# EasyEDA Pro project ESP32管灯熊猫.eprj

# Schematic Schematic1
Create Date: 2023-11-04; Page Name: P1; Project Name: ESP32管灯熊猫; Schematic Name: Schematic1; Update Date: 2023-11-04; Page Size: A4; Version: V1.0
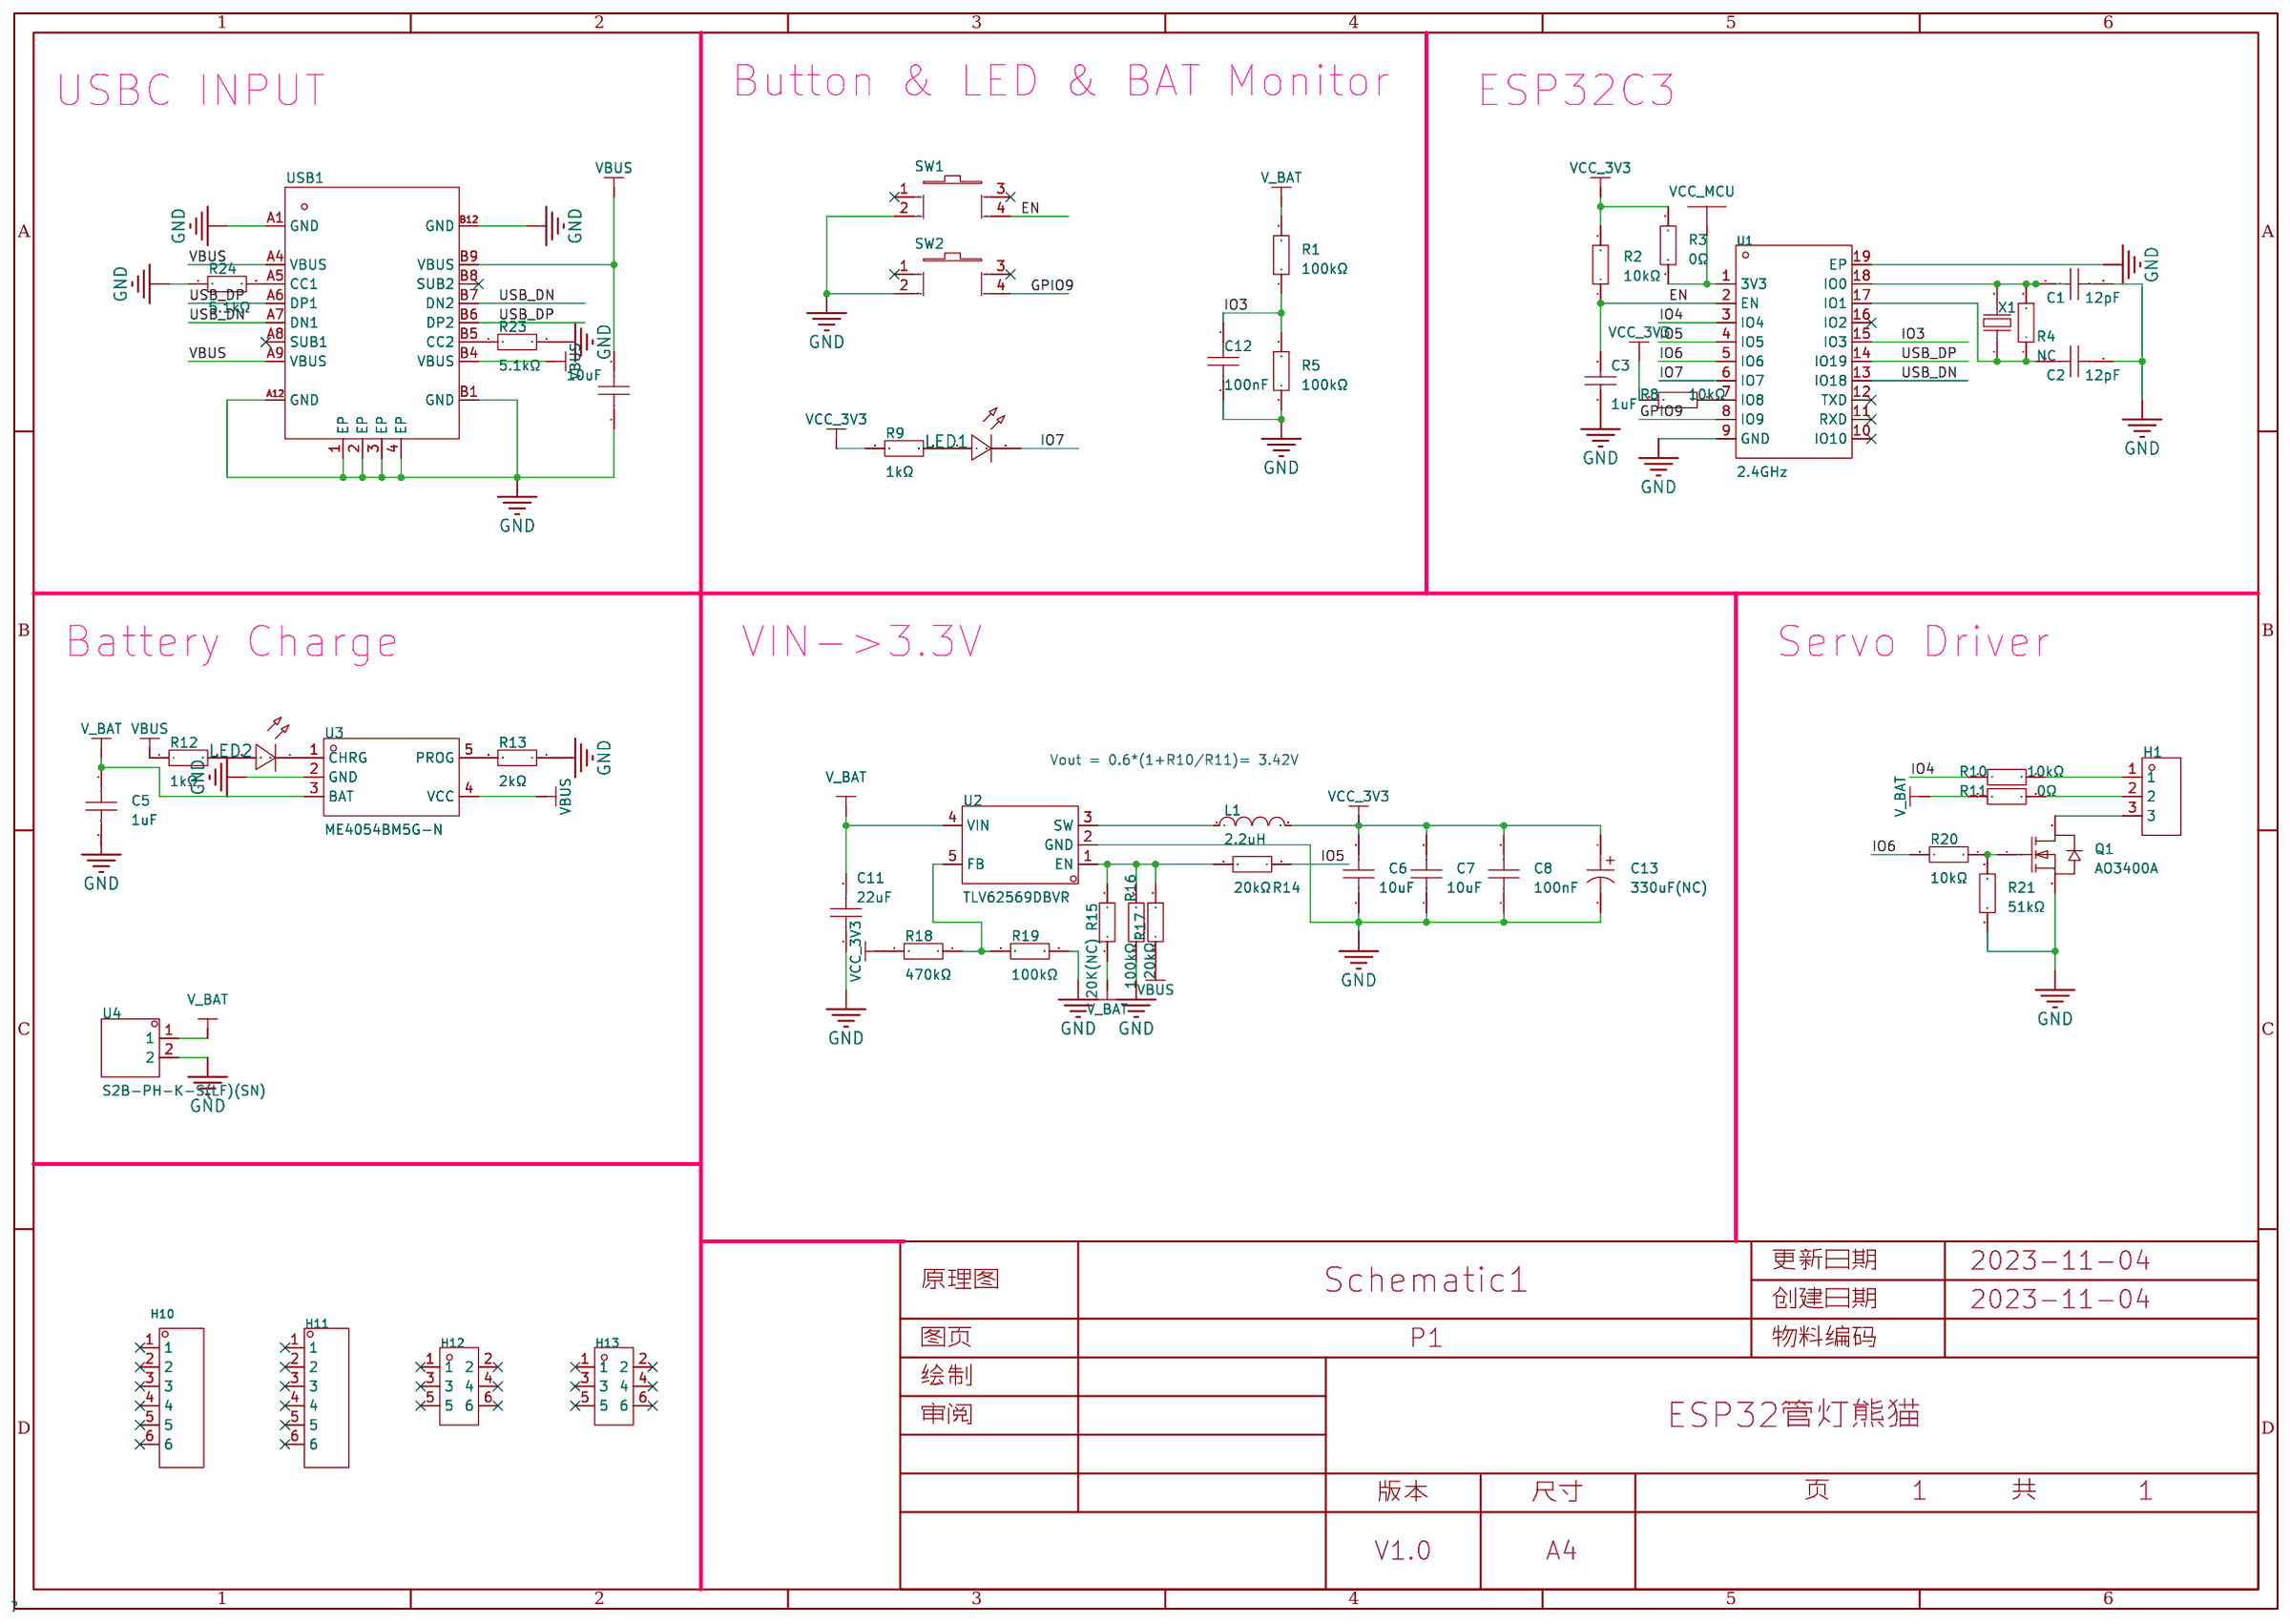
[diagram p0: schematic sheet]

## Parts
C1  12pF  [C0603]
C2  12pF  [C0603]
C3  1uF  [C0603]
C4  10uF  [C0603]
C5  1uF  [C0603]
C6  10uF  [C0603]
C7  10uF  [C0603]
C8  100nF  [C0603]
C11  22uF  [C0603]
C12  100nF  [C0603]
C13  330uF(NC)  [CAP-SMD_BD6.3-L6.6-W6.6-LS7.4-FD]
H1  -  [HDR-TH_3P-P2.54-V-M]
H10  B-2200S06P-A120  [HDR-TH_6P-P2.54-V-F]
H11  B-2200S06P-A120  [HDR-TH_6P-P2.54-V-F]
H12  X6511WVS-06H-C60D48R2  [HDR-SMD_6P-P2.54-V-M-LS4.8_R2]
H13  X6511WVS-06H-C60D48R2  [HDR-SMD_6P-P2.54-V-M-LS4.8_R2]
L1  2.2uH  [IND-SMD_L2.5-W2.0_SWPA2520]
LED1  19-217/BHC-ZL1M2RY/3T  [LED0603-FD_BLUE]
LED2  19-217/BHC-ZL1M2RY/3T  [LED0603-FD_BLUE]
Q1  AO3400A  [SOT-23-3_L2.9-W1.6-P1.90-LS2.8-BR]
R1  100kΩ  [R0603]
R2  10kΩ  [R0603]
R3  0Ω  [R0603]
R4  NC  [R0603]
R5  100kΩ  [R0603]
R8  10kΩ  [R0603]
R9  1kΩ  [R0603]
R10  10kΩ  [R0603]
R11  0Ω  [R0603]
R12  1kΩ  [R0603]
R13  2kΩ  [R0603]
R14  20kΩ  [R0603]
R15  20K(NC)  [R0603]
R16  100kΩ  [R0603]
R17  20kΩ  [R0603]
R18  470kΩ  [R0603]
R19  100kΩ  [R0603]
R20  10kΩ  [R0603]
R21  51kΩ  [R0603]
R23  5.1kΩ  [R0603]
R24  5.1kΩ  [R0603]
SW1  -  [SW-SMD_4P_PTS810SJM250SMTRLFS]
SW2  -  [SW-SMD_4P_PTS810SJM250SMTRLFS]
U1  2.4GHz  [BULETM-SMD_ESPRESSIF_ESP32-C3-WROOM-02-N4-4MB]
U2  TLV62569DBVR  [SOT-23-5_L3.0-W1.7-P0.95-LS2.8-BR]
U3  ME4054BM5G-N  [TSOT-23-5_L2.9-W1.6-P0.95-LS2.8-BL]
U4  S2B-PH-K-S(LF)(SN)  [CONN-TH_S2B-PH-K-S-LF-SN]
USB1  KH-TYPE-C-16P  [USB-C-SMD_KH-TYPE-C-16P]
X1  32.768kHz  [FC-135R_L3.2-W1.5]

## Library data of the parts
C1 C2 = CL10C120JB8NNNC: 容值:12pF;精度:±5%;额定电压:50V;材质(温度系数):C0G;; LCSC Part Name: 12pF ±5% 50V; Supplier Part: C38523; Manufacturer: SAMSUNG(三星); Supplier Footprint: 0603; JLCPCB Part Class: Basic Part; Datasheet: https://atta.szlcsc.com/upload/public/pdf/source/20160218/1457707763339.pdf; Supplier: LCSC; Tolerance: ±5%; Voltage Rated: 50V; Temperature Coefficient: C0G
C3 = CL10A105KA8NNNC: 容值:1uF;精度:±10%;额定电压:25V;温度系数:X5R;; LCSC Part Name: 1uF±10%25V; Supplier Part: C5673; Manufacturer: SAMSUNG(三星); Supplier Footprint: 0603; JLCPCB Part Class: ExtendedPart; Datasheet: https://atta.szlcsc.com/upload/public/pdf/source/20160103/1457707739994.pdf; Supplier: LCSC; Tolerance: ±10%; Voltage Rated: 25V; Temperature Coefficient: X5R
C4 = CL10A106MP8NNNC: 容值:10uF;精度:±20%;额定电压:10V;温度系数:X5R;; LCSC Part Name: 10uF±20%10V; Supplier Part: C85713; Manufacturer: SAMSUNG(三星); Supplier Footprint: 0603; JLCPCB Part Class: ExtendedPart; Datasheet: https://atta.szlcsc.com/upload/public/pdf/source/20161027/1477535406017.pdf; Supplier: LCSC; Tolerance: ±20%; Voltage Rated: 10V; Temperature Coefficient: X5R
C5 = CL10A105KB8NNNC: 容值:1uF;精度:±10%;额定电压:50V;材质(温度系数):X5R;; LCSC Part Name: 1uF ±10% 50V; Supplier Part: C15849; Manufacturer: SAMSUNG(三星); Supplier Footprint: 0603; JLCPCB Part Class: Basic Part; Datasheet: https://atta.szlcsc.com/upload/public/pdf/source/20160103/1457707679084.pdf; Supplier: LCSC; Tolerance: ±10%; Voltage Rated: 50V; Temperature Coefficient: X5R
C6 C7 = CL10A106KP8NNNC: 容值:10uF;精度:±10%;额定电压:10V;材质(温度系数):X5R;; LCSC Part Name: 10uF ±10% 10V; Supplier Part: C19702; Manufacturer: SAMSUNG(三星); Supplier Footprint: 0603; JLCPCB Part Class: Basic Part; Datasheet: https://atta.szlcsc.com/upload/public/pdf/source/20160103/1457707703378.pdf; Supplier: LCSC; Tolerance: ±10%; Voltage Rated: 10V; Temperature Coefficient: X5R
C8 C12 = CC0603KRX7R9BB104: 容值:100nF;精度:±10%;额定电压:50V;材质(温度系数):X7R;; LCSC Part Name: 100nF ±10% 50V; Supplier Part: C14663; Manufacturer: YAGEO(国巨); Supplier Footprint: 0603; JLCPCB Part Class: Basic Part; Datasheet: https://atta.szlcsc.com/upload/public/pdf/source/20180910/C282072_33301C7F631E79921B82A8DAC6BCC5B3.pdf; Supplier: LCSC; Tolerance: ±10%; Voltage Rated: 50V; Temperature Coefficient: X7R
C11 = CL10A226MQ8NRNC: 容值:22uF;精度:±20%;额定电压:6.3V;材质(温度系数):X5R;; LCSC Part Name: 22uF ±20% 6.3V; Supplier Part: C59461; Manufacturer: SAMSUNG(三星); Supplier Footprint: 0603; JLCPCB Part Class: Basic Part; Datasheet: https://atta.szlcsc.com/upload/public/pdf/source/20160103/1457707740762.pdf; Supplier: LCSC; Tolerance: ±20%; Voltage Rated: 6.3V; Temperature Coefficient: X5R
C13 = RVT0J331M0605: 容值:330uF;精度:±20%;额定电压:6.3V;; LCSC Part Name: 330uF ±20% 6.3V; Supplier Part: C2999060; Manufacturer: ROQANG(容强); Supplier Footprint: SMD,D6.3xL5.4mm; JLCPCB Part Class: Extended Part; Datasheet: https://atta.szlcsc.com/upload/public/pdf/source/20170325/1490427950282.pdf; Supplier: LCSC; Tolerance: ±20%; Rated Voltage: 6.3V; φD: 6.3mm; L: 5.4mm; Lifetime @ Temp: 2000hrs@105℃; Operating Temperature: -55℃~+105℃
H1 = HDR-M_2.54_1x3P: Supplier Part: C2937625; Supplier Footprint: 插件; Check: false
H10 H11 = B-2200S06P-A120: 排数:单排;总孔位数:6;间距:2.54mm;插孔结构:1x6P;行距:-;安装类型:直插;塑高:-;触头材质:黄铜;触头镀层:-;; LCSC Part Name: 2.54mm 1x6P; Supplier Part: C124415; Manufacturer: Ckmtw(灿科盟); Supplier Footprint: 直插,P=2.54mm; JLCPCB Part Class: Extended Part; Supplier: LCSC; Number of Rows: 单排; Number of Holes: 6; Pitch: 2.54mm; Holes Structure: 1x6P; Mounting Type: 直插; Contact Material: 黄铜
H12 H13 = X6511WVS-06H-C60D48R2: 排数:单排;总PIN位数:6P;间距:2.54mm;插针结构:1x6P;行距:-;安装类型:立贴;圆针/方针:方针;额定电流:3A;额定电压:250V;配合针长度:6mm;塑高:2.5mm;触头材质:黄铜;触头镀层:金;工作温度范围:-40℃~+105℃;焊接温度(最大值):260℃;颜色:黑色;; LCSC Part Name: 2.54mm 1x6P 立贴 方针; Supplier Part: C2883763; Manufacturer: XKB Connectivity(中国星坤); Supplier Footprint: SMD,P=2.54mm,卧贴(交错脚); JLCPCB Part Class: Extended Part; Datasheet: https://atta.szlcsc.com/upload/public/pdf/source/20200909/C780060_F941EB1B69F43B5D6329EAF74E2E27BB.pdf; Supplier: LCSC; Number of Rows: 单排; Number of Pins: 6P; Pitch: 2.54mm; Pin Structure: 1x6P; Mounting Type: 立贴; Circluar Pins/Square Pins: 方针; Current Rating (Max): 3A; Voltage Rating (Max): 250V; Length of Mating Pin: 6mm; Insulation Height: 2.5mm; Contact Material: 黄铜; Contact Plating: 金; Operating Temperature Range: -40℃~+105℃; Welding Temperature (Max): 260℃; Color: 黑色
L1 = SWPA252012S2R2MT: 电感值:2.2uH;精度:±20%;额定电流:1.25A;直流电阻(DCR):216mΩ;; LCSC Part Name: 2.2uH ±20% 1.25A 216mΩ; Supplier Part: C23894; Manufacturer: Sunlord(顺络); Supplier Footprint: SMD; JLCPCB Part Class: Extended Part; Datasheet: https://atta.szlcsc.com/upload/public/pdf/source/20210916/AC798BA7E846B7D0B6818F45CD84DB0B.pdf; Supplier: LCSC; Tolerance: ±20%; Rated Current: 1.25A; DC Resistance (DCR): 216mΩ
LED1 LED2 = 19-217/BHC-ZL1M2RY/3T: 发光颜色:蓝灯;二极管配置:-;主波长:465nm~475nm;色温:-;功率:110mW;安装方式:-;; LCSC Part Name: 蓝灯; Supplier Part: C72041; Manufacturer: EVERLIGHT(亿光); Supplier Footprint: 0603; JLCPCB Part Class: Basic Part; Datasheet: https://atta.szlcsc.com/upload/public/pdf/source/20170116/1484561237273.pdf; Supplier: LCSC; Emitted Color: 蓝灯; Lens Color: 无色透明; Dominant Wavelength: 465nm~475nm; Peak Wavelength: 468nm; Forward Current: 5mA; Power Dissipation: 110mW; Viewing Angle: 120°; Operating Temperature: -40℃~+85℃; Check: false
Q1 = AO3400A_C20917: 类型:N沟道;漏源电压(Vdss):30V;连续漏极电流(Id):5.7A;功率(Pd):1.4W;导通电阻(RDS(on)@Vgs,Id):26.5mΩ@10V,5.7A;; LCSC Part Name: N沟道 30V 5.7A; Supplier Part: C20917; Manufacturer: AOS; Supplier Footprint: SOT-23-3L; JLCPCB Part Class: Basic Part; Datasheet: https://atta.szlcsc.com/upload/public/pdf/source/20140107/1457706668533.pdf; Supplier: LCSC; Type: N沟道; Drain Source Voltage (Vdss): 30V; Continuous Drain Current (Id): 5.7A; Power Dissipation (Pd): 1.4W; Drain Source On Resistance (RDS(on)@Vgs,Id): 26.5mΩ@10V,5.7A; Gate Threshold Voltage (Vgs(th)@Id): 1.5V@250uA
R1 R5 R16 R19 = 0603WAF1003T5E: 电阻类型:厚膜电阻;阻值:100kΩ;精度:±1%;功率:100mW;; LCSC Part Name: 100kΩ ±1% 100mW; Supplier Part: C25803; Manufacturer: UNI-ROYAL(厚声); Supplier Footprint: 0603; JLCPCB Part Class: Basic Part; Datasheet: https://atta.szlcsc.com/upload/public/pdf/source/20200306/C422600_1E6D84923E4A46A82E41ADD87F860B5C.pdf; Supplier: LCSC; Type: 厚膜电阻; Tolerance: ±1%; Power(Watts): 100mW; Temperature Coefficient: ±100ppm/℃; Overload Voltage (Max): 75V; Operating Temperature Range: -55℃~+155℃
R2 R8 R10 R20 = 0603WAF1002T5E: 电阻类型:厚膜电阻;阻值:10kΩ;精度:±1%;功率:100mW;; LCSC Part Name: 厚膜电阻 10kΩ ±1% 100mW; Supplier Part: C25804; Manufacturer: UNI-ROYAL(厚声); Supplier Footprint: 0603; JLCPCB Part Class: Basic Part; Datasheet: https://atta.szlcsc.com/upload/public/pdf/source/20200306/C422600_1E6D84923E4A46A82E41ADD87F860B5C.pdf; Supplier: LCSC; Type: 厚膜电阻; Tolerance: ±1%; Power(Watts): 100mW; Temperature Coefficient: ±100ppm/℃; Overload Voltage (Max): 75V; Operating Temperature Range: -55℃~+155℃
R3 R11 = 0603WAF0000T5E: 电阻类型:厚膜电阻;阻值:0Ω;精度:±1%;功率:100mW;; LCSC Part Name: 0Ω ±1% 100mW; Supplier Part: C21189; Manufacturer: UNI-ROYAL(厚声); Supplier Footprint: 0603; JLCPCB Part Class: Basic Part; Datasheet: https://atta.szlcsc.com/upload/public/pdf/source/20200306/C422600_1E6D84923E4A46A82E41ADD87F860B5C.pdf; Supplier: LCSC; Type: 厚膜电阻; Tolerance: ±1%; Power(Watts): 100mW; Overload Voltage (Max): 75V; Operating Temperature Range: -55℃~+155℃
R4 = Res_0603: Supplier Footprint: 0603; Check: false
R9 R12 = 0603WAF1001T5E: 电阻类型:厚膜电阻;阻值:1kΩ;精度:±1%;功率:100mW;; LCSC Part Name: 1kΩ ±1% 100mW; Supplier Part: C21190; Manufacturer: UNI-ROYAL(厚声); Supplier Footprint: 0603; JLCPCB Part Class: Basic Part; Datasheet: https://atta.szlcsc.com/upload/public/pdf/source/20200306/C422600_1E6D84923E4A46A82E41ADD87F860B5C.pdf; Supplier: LCSC; Type: 厚膜电阻; Tolerance: ±1%; Power(Watts): 100mW; Temperature Coefficient: ±100ppm/℃; Overload Voltage (Max): 75V; Operating Temperature Range: -55℃~+155℃
R13 = 0603WAF2001T5E: 电阻类型:厚膜电阻;阻值:2kΩ;精度:±1%;功率:100mW;; LCSC Part Name: 2kΩ ±1% 100mW; Supplier Part: C22975; Manufacturer: UNI-ROYAL(厚声); Supplier Footprint: 0603; JLCPCB Part Class: Basic Part; Datasheet: https://atta.szlcsc.com/upload/public/pdf/source/20200306/C422600_1E6D84923E4A46A82E41ADD87F860B5C.pdf; Supplier: LCSC; Type: 厚膜电阻; Tolerance: ±1%; Power(Watts): 100mW; Temperature Coefficient: ±100ppm/℃; Overload Voltage (Max): 75V; Operating Temperature Range: -55℃~+155℃
R14 R17 = 0603WAF2002T5E: 电阻类型:厚膜电阻;阻值:20kΩ;精度:±1%;功率:100mW;; LCSC Part Name: 20kΩ ±1% 100mW; Supplier Part: C4184; Manufacturer: UNI-ROYAL(厚声); Supplier Footprint: 0603; JLCPCB Part Class: Basic Part; Datasheet: https://atta.szlcsc.com/upload/public/pdf/source/20200306/C422600_1E6D84923E4A46A82E41ADD87F860B5C.pdf; Supplier: LCSC; Type: 厚膜电阻; Tolerance: ±1%; Power(Watts): 100mW; Temperature Coefficient: ±100ppm/℃; Overload Voltage (Max): 75V; Operating Temperature Range: -55℃~+155℃
R15 = Res_0402: Supplier Footprint: 0402; Check: false
R18 = 0603WAF4703T5E: 电阻类型:厚膜电阻;阻值:470kΩ;精度:±1%;功率:100mW;; LCSC Part Name: 470kΩ ±1% 100mW; Supplier Part: C23178; Manufacturer: UNI-ROYAL(厚声); Supplier Footprint: 0603; JLCPCB Part Class: Basic Part; Datasheet: https://atta.szlcsc.com/upload/public/pdf/source/20200306/C422600_1E6D84923E4A46A82E41ADD87F860B5C.pdf; Supplier: LCSC; Type: 厚膜电阻; Tolerance: ±1%; Power(Watts): 100mW; Temperature Coefficient: ±100ppm/℃; Overload Voltage (Max): 75V; Operating Temperature Range: -55℃~+155℃
R21 = 0603WAF5102T5E: 电阻类型:厚膜电阻;阻值:51kΩ;精度:±1%;功率:100mW;; LCSC Part Name: 51kΩ ±1% 100mW; Supplier Part: C23196; Manufacturer: UNI-ROYAL(厚声); Supplier Footprint: 0603; JLCPCB Part Class: Basic Part; Datasheet: https://atta.szlcsc.com/upload/public/pdf/source/20200306/C422600_1E6D84923E4A46A82E41ADD87F860B5C.pdf; Supplier: LCSC; Type: 厚膜电阻; Tolerance: ±1%; Power(Watts): 100mW; Temperature Coefficient: ±100ppm/℃; Overload Voltage (Max): 75V; Operating Temperature Range: -55℃~+155℃
R23 R24 = 0603WAF5101T5E: 电阻类型:厚膜电阻;阻值:5.1kΩ;精度:±1%;功率:100mW;; LCSC Part Name: 5.1kΩ ±1% 100mW; Supplier Part: C23186; Manufacturer: UNI-ROYAL(厚声); Supplier Footprint: 0603; JLCPCB Part Class: Basic Part; Datasheet: https://atta.szlcsc.com/upload/public/pdf/source/20200306/C422600_1E6D84923E4A46A82E41ADD87F860B5C.pdf; Supplier: LCSC; Type: 厚膜电阻; Tolerance: ±1%; Power(Watts): 100mW; Temperature Coefficient: ±100ppm/℃; Overload Voltage (Max): 75V; Operating Temperature Range: -55℃~+155℃
SW1 SW2 = PTS810SJS250SMTRLFS: 触点电流:50mA;额定电压(DC):16V;电路结构:单刀单掷;安装方式:-;按钮形状:圆形按钮;带灯:-;开关长度:4.2mm;开关宽度:3.2mm;开关高度:2.5mm;; LCSC Part Name: 轻触开关4.2mm*3.2mm，600gf; Supplier Part: C221897; Manufacturer: C&amp;K; Supplier Footprint: 4.2x3.2mm; JLCPCB Part Class: ExtendedPart; Datasheet: https://atta.szlcsc.com/upload/public/pdf/source/20180613/C221897_9316320DEFA4333FA0E6C5D565B0D5EA.pdf; Supplier: LCSC; Contact Current: 50mA; Voltage Rating (DC): 16V; Circuit: 单刀单掷; Actuator Style: 圆形按钮; Switch Length: 4.2mm; Switch Width: 3.2mm; Switch Height: 2.5mm
U1 = ESP32-C3-WROOM-02-N4: 频率:2.4GHz;发射功率:20.5dBm;核心处理器:ESP32-C3;; Supplier Part: C2934560; Manufacturer: ESPRESSIF(乐鑫); Supplier Footprint: VFQFN-32-EP; JLCPCB Part Class: Extended Part; Datasheet: https://atta.szlcsc.com/upload/public/pdf/source/20220106/F07459EFFE1D7CBA94B4FB8A075146A6.pdf; Supplier: LCSC; Output Power: 20.5dBm; Core Processor: ESP32-C3; Support Interface: I2C；GPIO；SPI；JTAG；UART；USB；I2S
U2 = TLV62569DBVR: 功能类型:降压型;输出类型:可调;输入电压:2.5V~5.5V;输出电压:600mV~5.5V;输出电流(最大值):2A;; LCSC Part Name: 降压型 输入2.5V~5.5V 输出600mV~5.5V 2A; Supplier Part: C141836; Manufacturer: TI(德州仪器); Supplier Footprint: SOT-23-5; JLCPCB Part Class: Extended Part; Datasheet: https://atta.szlcsc.com/upload/public/pdf/source/20180423/C141836_1FC17A3D2C2E4ECD339DF92B83CED618.pdf; Supplier: LCSC; Function: 降压型; Synchronous Rectification: 是; Output Type: 可调; Topology: 降压式; Input Voltage: 2.5V~5.5V; Output Voltage: 600mV~5.5V; Output Current (Max): 2A; Switching Frequency: 1.5MHz; Operating Temperature: -40℃~+125℃@(TJ)
U3 = ME4054BM5G-N: Supplier Part: C478383; Manufacturer: MICRONE(南京微盟); Supplier Footprint: SOT-23-5; JLCPCB Part Class: Extended Part; Datasheet: https://atta.szlcsc.com/upload/public/pdf/source/20191226/C478383_334A5ED125CA9F8F85F7DE0AC0ECFE6D.pdf; Supplier: LCSC
U4 = S2B-PH-K-S(LF)(SN): 参考系列:PH;间距:2mm;插针结构:1x2P;排数:1;每排PIN数:2;行距:-;安装方式:-;触头材质:黄铜;; LCSC Part Name: PH 2mm 1x2P 打K; Supplier Part: C173752; Manufacturer: JST; Supplier Footprint: 弯插,P=2mm; JLCPCB Part Class: Extended Part; Datasheet: https://atta.szlcsc.com/upload/public/pdf/source/20180327/C173752_5C91EDA4B54CB1D33BA17C4D2B983D44.pdf; Supplier: LCSC; Reference Series: PH; Pitch: 2mm; Pins Structure: 1x2P; Number of Rows: 1; Number of PINs Per Row: 2; Contact Material: 黄铜
USB1 = KH-TYPE-C-16P: Type-C母座 16PIN 立式四角贴板无压片; LCSC Part Name: Type-C母座; Supplier Part: C709357; Manufacturer: kinghelm(金航标); JLCPCB Part Class: Extended Part; Supplier: LCSC
X1 = Q13FC1350000400: 频率:32.768kHz;频率公差:±20ppm;负载电容:12.5pF;; LCSC Part Name: 32.768kHz ±20ppm 12.5pF; Supplier Part: C32346; Manufacturer: EPSON(爱普生); Supplier Footprint: SMD3215-2P; JLCPCB Part Class: Basic Part; Datasheet: https://atta.szlcsc.com/upload/public/pdf/source/20190108/C32346_746D6B07EAF90824457A96480007685F.pdf; Supplier: LCSC; Crystal Type: 贴片无源晶振; Frequency Tolerance: ±20ppm; Load Capacitance: 12.5pF; Equivalent Series Resistance (ESR): 70kΩ; Operating Temperature: -40℃~+85℃

## Nets
GND: C1.2 C2.2 C3.1 C4.1 C5.2 C6.1 C7.1 C8.1 C11.1 C12.1 C13.2 Q1.2(S) R5.1 R13.1 R16.1 R19.1 R21.1 R23.2 R24.1 SW1.2 SW2.2 U1.9(GND) U1.19(EP) U2.2(GND) U3.2(GND) U4.2 USB1.1(EP) USB1.2(EP) USB1.3(EP) USB1.4(EP) USB1.A1(GND) USB1.A12(GND) USB1.B1(GND) USB1.B12(GND)
VBUS: C4.2 R12.1 R17.1 U3.4(VCC) USB1.A4(VBUS) USB1.A9(VBUS) USB1.B4(VBUS) USB1.B9(VBUS)
VCC_3V3: C6.2 C7.2 C8.2 C13.1 L1.2 R2.2 R3.2 R8.2 R9.1 R18.2
VCC_MCU: R3.1 U1.1(3V3)
EN: C3.2 R2.1 SW1.4 U1.2(EN)
GPIO9: SW2.4 U1.8(IO9)
IO3: C12.2 R1.1 R5.2 U1.15(IO3)
IO4: R10.1 U1.3(IO4)
IO5: R14.1 U1.4(IO5)
IO6: R20.2 U1.5(IO6)
IO7: LED1.1(C) U1.6(IO7)
USB_DN: U1.13(IO18) USB1.A7(DN1) USB1.B7(DN2)
USB_DP: U1.14(IO19) USB1.A6(DP1) USB1.B6(DP2)
V_BAT: C5.1 C11.2 R1.2 R11.1 R15.1 U2.4(VIN) U3.3(BAT) U4.1
$1N674: R13.2 U3.5(PROG)
$1N676: LED2.1(C) U3.1(CHRG)
$1N677: LED2.2(A) R12.2
$1N1245: L1.1 U2.3(SW)
$1N1252: R18.1 R19.2 U2.5(FB)
$1N1257: R14.2 R15.2 R16.2 R17.2 U2.1(EN)
$1N2149: C1.1 R4.2 U1.18(IO0) X1.2
$1N2152: C2.1 R4.1 U1.17(IO1) X1.1
$1N2392: R8.1 U1.7(IO8)
$1N2588: LED1.2(A) R9.2
$1N2840: H1.1 R10.2
$1N2843: H1.3 Q1.3(D)
$1N2877: H1.2 R11.2
$1N7161: Q1.1(G) R20.1 R21.2
$1N33513: R23.1 USB1.B5(CC2)
$1N33602: R24.2 USB1.A5(CC1)

Not connected (* = marked no-connect by the designer): H10 1* 2* 3* 4* 5* 6*; H11 1* 2* 3* 4* 5* 6*; H12 1* 2* 3* 4* 5* 6*; H13 1* 2* 3* 4* 5* 6*; SW1 1* 3*; SW2 1* 3*; U1 10(IO10)* 11(RXD)* 12(TXD)* 16(IO2)*; USB1 A8(SUB1)* B8(SUB2)*

## Notes on the sheet
- USBC INPUT
- Button & LED & BAT Monitor
- ESP32C3
- Battery Charge
- VIN->3.3V
- Servo Driver
- Vout = 0.6*(1+R10/R11)= 3.42V

# Board PCB1
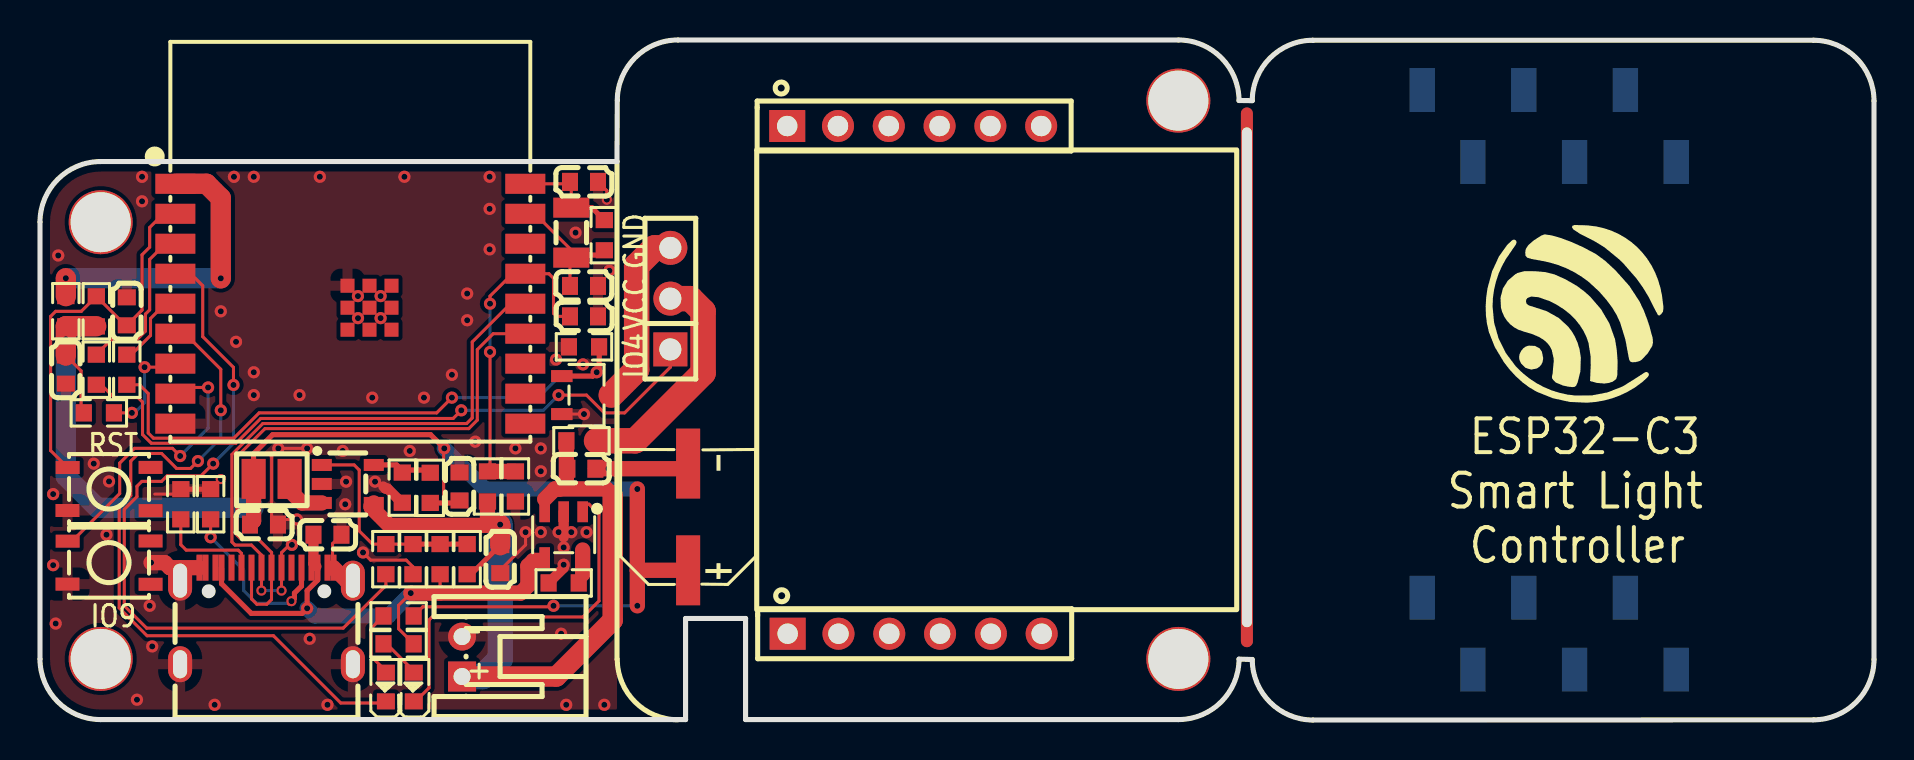
[diagram p1: board, top side]
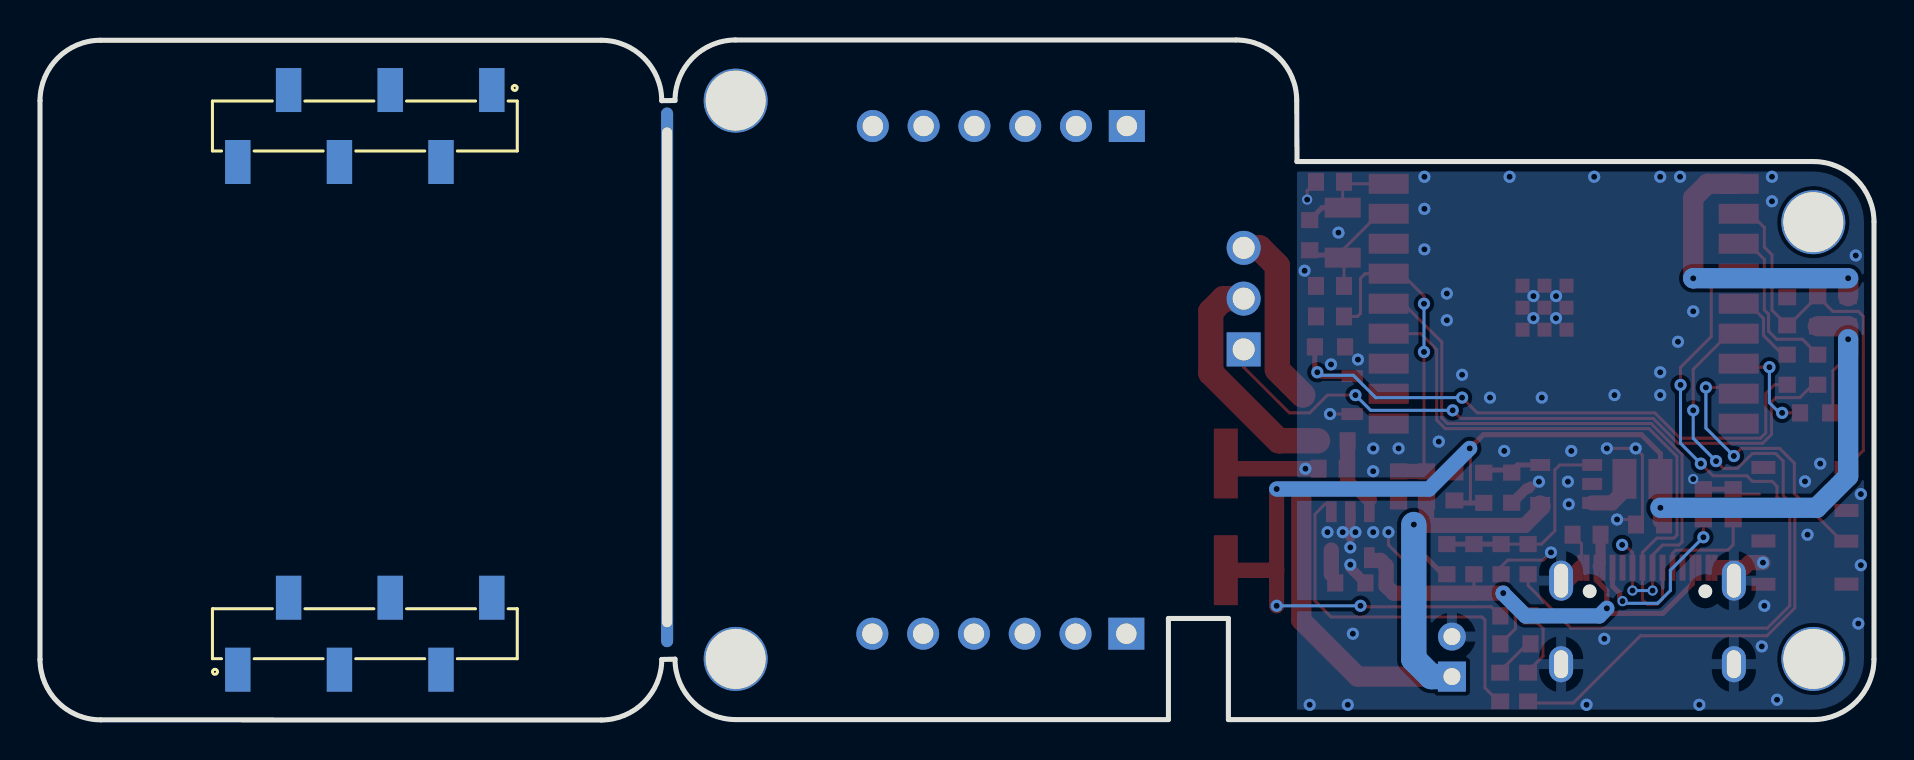
[diagram p2: board, bottom side, seen from below]

Outline 91.7 x 34.02 mm; copper layers: Top Layer, Bottom Layer. Coordinates in mm from the lower left corner of the outline.
Outline path: 0,24.92 arc(0.89,27.05) 3.03,27.94 28.85,27.94 28.87,31 arc(29.76,33.14) 31.89,34.02 56.93,34.02 arc(59.07,33.13) 59.95,30.99 60.62,30.99 arc(61.51,33.12) 63.64,34.01 88.68,34.01 arc(90.82,33.12) 91.7,30.98 91.7,3.03 arc(90.81,0.9) 88.67,0.01 63.64,0 arc(61.5,0.89) 60.62,3.03 59.95,3.05 arc(59.06,0.91) 56.92,0.02 35.28,0.02 35.28,5.08 32.28,5.08 32.28,0.02 3.02,0.02 arc(0.89,0.91) 0,3.05 0,24.92
Stack: Top Layer 0.035mm / Dielectric1 1.51mm FR4 er 4.5 / Bottom Layer 0.035mm

## Design rules (mm)
template: JLCPCB Capability(Two Layers Board)
spacing copperThickness1oz (default): track to track 0.102, other pairs 0.152 to 0.3
spacing copperThickness2oz: track to track 0.203, other pairs 0.152 to 0.3
track width copperThickness1oz (default): min 0.127, default 0.254, max 2.54
track width copperThickness2oz: min 0.203, default 0.254, max 2.54
differential pair differentialPair (default): width min 0.127, default 0.254, max 2.54; gap min 0.152, default 0.152
via viaSize (default): diameter min 0.5, default 0.61, max 10; hole min 0.3, default 0.305, max 6.3

## Placement (name value [footprint] x y rotation side)
C1  12pF  [C0603]  27.2 26.92 0 top
C2  12pF  [C0603]  27.2 21.72 0 top
C3  1uF  [C0603]  4.34 20.45 270 top
C4  10uF  [C0603]  14.37 9.27 180 top
C5  1uF  [C0603]  27.07 12.57 0 top
C6  10uF  [C0603]  20.98 11.68 270 top
C7  10uF  [C0603]  1.29 17.53 90 top
C8  100nF  [C0603]  11.2 9.78 180 top
C11  22uF  [C0603]  23.01 8.05 90 top
C12  100nF  [C0603]  27.2 20.19 180 top
C13  330uF(NC)  [CAP-SMD_BD6.3-L6.6-W6.6-LS7.4-FD]  32.41 10.16 90 top
H1  -  [HDR-TH_3P-P2.54-V-M]  31.52 21.08 90 top
H10  B-2200S06P-A120  [HDR-TH_6P-P2.54-V-F]  43.71 29.72 0 top
H11  B-2200S06P-A120  [HDR-TH_6P-P2.54-V-F]  43.73 4.32 0 top
H12  X6511WVS-06H-C60D48R2  [HDR-SMD_6P-P2.54-V-M-LS4.8_R2]  75.46 4.32 180 bottom
H13  X6511WVS-06H-C60D48R2  [HDR-SMD_6P-P2.54-V-M-LS4.8_R2]  75.46 29.72 0 bottom
L1  2.2uH  [IND-SMD_L2.5-W2.0_SWPA2520]  11.58 12.06 180 top
LED1  19-217/BHC-ZL1M2RY/3T  [LED0603-FD_BLUE]  17.29 1.65 90 top
LED2  19-217/BHC-ZL1M2RY/3T  [LED0603-FD_BLUE]  18.69 1.65 90 top
NOREF  -  [Pad_e113]  56.92 3.06 90 top
NOREF#2  -  [Pad_e63]  60.35 17.14 0 top
NOREF#3  -  [Pad_e115]  3.03 3.06 0 top
NOREF#4  -  [Pad_e237]  3.03 24.91 270 top
NOREF#5  -  [Pad_e22]  56.92 30.99 180 top
Q1  AO3400A  [SOT-23-3_L2.9-W1.6-P1.90-LS2.8-BR]  27.33 16.26 180 top
R1  100kΩ  [R0603]  22.37 11.68 270 top
R2  10kΩ  [R0603]  2.82 20.45 270 top
R3  0Ω  [R0603]  1.29 20.45 270 top
R4  NC  [R0603]  28.22 24.26 90 top
R5  100kΩ  [R0603]  23.77 11.68 90 top
R8  10kΩ  [R0603]  2.94 15.37 180 top
R9  1kΩ  [R0603]  17.93 5.21 180 top
R10  10kΩ  [R0603]  2.82 17.53 270 top
R11  0Ω  [R0603]  27.07 13.97 0 top
R12  1kΩ  [R0603]  17.93 3.81 180 top
R13  2kΩ  [R0603]  26.18 6.86 0 top
R14  20kΩ  [R0603]  17.29 8.05 90 top
R15  20K(NC)  [R0603]  21.36 8.05 90 top
R16  100kΩ  [R0603]  18.65 8.05 90 top
R17  20kΩ  [R0603]  20 8.05 90 top
R18  470kΩ  [R0603]  19.51 11.62 270 top
R19  100kΩ  [R0603]  18.12 11.62 90 top
R20  10kΩ  [R0603]  4.34 17.53 90 top
R21  51kΩ  [R0603]  27.2 18.67 0 top
R23  5.1kΩ  [R0603]  8.53 10.8 90 top
R24  5.1kΩ  [R0603]  7.04 10.8 270 top
SW1  -  [SW-SMD_4P_PTS810SJM250SMTRLFS]  3.45 11.56 180 top
SW2  -  [SW-SMD_4P_PTS810SJM250SMTRLFS]  3.45 7.87 180 top
U1  2.4GHz  [BULETM-SMD_ESPRESSIF_ESP32-C3-WROOM-02-N4-4MB]  15.52 20.83 0 top
U2  TLV62569DBVR  [SOT-23-5_L3.0-W1.7-P0.95-LS2.8-BR]  15.39 11.81 180 top
U3  ME4054BM5G-N  [TSOT-23-5_L2.9-W1.6-P0.95-LS2.8-BL]  26.18 9.27 180 top
U4  S2B-PH-K-S(LF)(SN)  [CONN-TH_S2B-PH-K-S-LF-SN]  21.1 3.17 270 top
USB1  KH-TYPE-C-16P  [USB-C-SMD_KH-TYPE-C-16P]  11.33 5.21 0 top
X1  32.768kHz  [FC-135R_L3.2-W1.5]  26.57 24.38 90 top

## Footprints (pads in the part's own frame, mm; a bottom-side part is the same pattern mirrored in y, then rotated)
BULETM-SMD_ESPRESSIF_ESP32-C3-WROOM-02-N4-4MB
  rect 2x1 smd: 1(-8.75,6) 2(-8.75,4.5) 3(-8.75,3) 4(-8.75,1.5) 5(-8.75,0) 6(-8.75,-1.5) 7(-8.75,-3) 8(-8.75,-4.5) 9(-8.75,-6) 10(8.75,-6) 11(8.75,-4.5) 12(8.75,-3) 13(8.75,-1.5) 14(8.75,0) 15(8.75,1.5) 16(8.75,3) 17(8.75,4.5) 18(8.75,6)
  rect 0.7x0.7 smd: 19(-0.14,0.9) 19(-0.14,-0.2) 19(-0.14,-1.3) 19(0.96,0.9) 19(0.96,-0.2) 19(0.96,-1.3) 19(2.06,0.9) 19(2.06,-0.2) 19(2.06,-1.3)
C0603
  rect 0.8x0.9 smd: 1(-0.7,0) 2(0.7,0)
CAP-SMD_BD6.3-L6.6-W6.6-LS7.4-FD
  rect 3.5x1.2 smd: 1(-2.67,0) 2(2.67,0)
CONN-TH_S2B-PH-K-S-LF-SN
  rect 1.5x1.4 hole 0.85: 1(1,0)
  round 1.4 hole 0.85: 2(-1,0)
FC-135R_L3.2-W1.5
  rect 1x1.8 smd: 1(-1.25,0) 2(1.25,0)
HDR-SMD_6P-P2.54-V-M-LS4.8_R2
  rect 1.27x2.2 smd: 1(-6.35,-1.8) 2(-3.81,1.8) 3(-1.27,-1.8) 4(1.27,1.8) 5(3.81,-1.8) 6(6.35,1.8)
HDR-TH_3P-P2.54-V-M
  rect 1.7x1.7 hole 1.1: 1(-2.54,0)
  round 1.7 hole 1.1: 2(0,0) 3(2.54,0)
HDR-TH_6P-P2.54-V-F
  rect 1.8x1.6 hole 1.02: 1(-6.35,0)
  round 1.6 hole 1.02: 2(-3.81,0) 3(-1.27,0) 4(1.27,0) 5(3.81,0) 6(6.35,0)
IND-SMD_L2.5-W2.0_SWPA2520
  rect 1.2x2 smd: 1(-0.9,0) 2(0.9,0)
LED0603-FD_BLUE
  rect 0.8x0.9 smd: 1(-0.72,0) 2(0.72,0)
Pad_e22
  round 3.2 hole 3: 1(0,0)
Pad_e63
  oval 0.6x27 hole 0.5x25: 1(0,0)
Pad_e113
  round 3.2 hole 3: 1(0,0)
Pad_e115
  round 3.2 hole 3: 1(0,0)
Pad_e237
  round 3.2 hole 3: 1(0,0)
R0603
  rect 0.806x0.864 smd: 1(-0.753,0) 2(0.753,0)
SOT-23-3_L2.9-W1.6-P1.90-LS2.8-BR
  rect 1.07x0.6 smd: 1(1.235,-0.95) 2(1.235,0.95) 3(-1.235,0)
SOT-23-5_L3.0-W1.7-P0.95-LS2.8-BR
  rect 1x0.6 smd: 1(1.3,-0.95) 2(1.3,0) 3(1.3,0.95) 4(-1.3,0.95) 5(-1.3,-0.95)
SW-SMD_4P_PTS810SJM250SMTRLFS
  rect 1.199x0.65 smd: 1(-2.078,1.082) 2(2.078,1.075) 3(-2.078,-1.082) 4(2.07,-1.075)
TSOT-23-5_L2.9-W1.6-P0.95-LS2.8-BL
  rect 0.532x1.045 smd: 1(-0.95,-1.147) 2(0,-1.147) 3(0.95,-1.147) 4(0.95,1.147) 5(-0.95,1.147)
USB-C-SMD_KH-TYPE-C-16P
  oval 1.2x2 hole 0.7x1.7: 1(-4.32,1.765) 2(4.32,1.765)
  oval 1.2x1.8 hole 0.7x1.4: 3(-4.32,-2.415) 4(4.32,-2.415)
  rect 0.3x1.3 smd: A1(-3.35,2.415) A4(-2.55,2.415) A5(-1.25,2.415) A6(-0.25,2.415) A7(0.25,2.415) A8(1.25,2.415) A9(2.55,2.415) A12(3.35,2.415) B1(3.05,2.415) B4(2.25,2.415) B5(1.75,2.415) B6(0.75,2.415) B7(-0.75,2.415) B8(-1.75,2.415) B9(-2.25,2.415) B12(-3.05,2.415)

## Nets
As in the schematic.

Pads without a net: H10 1 2 3 4 5 6; H11 1 2 3 4 5 6; H12 1 2 3 4 5 6; H13 1 2 3 4 5 6; NOREF 1; NOREF#2 1; NOREF#3 1; NOREF#4 1; NOREF#5 1; SW1 1 3; SW2 1 3; U1 10 11 12 16; USB1 A8 B8

## Via types
v1: diameter 0.61, hole 0.305, Top Layer to Bottom Layer, 93 vias
v2: diameter 0.508, hole 0.305, Top Layer to Bottom Layer, 5 vias

## Routing (per net, layer and track width the routed paths; a pad name or vN(x,y) marks a point on that pad's centre or on a via; arc(x,y) is an arc through that point)
GND: length 32.3
  Top Layer w0.152: C11.1 23.01,7.5 24.28,8.76 v1(24.28,9.4) ; R16.1 18.65,7.66 18.31,8 16.53,8 v1(16.15,8.38) ; v1(12.85,10.03) 12.15,10.03 C8.1 11.58,10.1 11.58,13.25 v1(11.92,13.59) v1(13.36,13.59) ; R24.1 6.8,11.3 5.74,11.3 ; 14.63,7.67 14.63,8.82 C4.1 ; 26.09,15.31 v1(27.2,15.31) ; C1.2 28.34,26.48 v2(28.34,26.03) ; R23.2 v2(9.04,12.06) 9.04,12.06
  Top Layer w0.254: R24.1 R23.2
  Top Layer w0.508: 17.17,11.68 17.27,11.58 17.38,11.58 18.09,10.87 R19.1 ; U3.2 26.18,9.14 ; v1(26.18,7.77) 26.18,7.61 R13.1
  Top Layer w0.762: v1(5.55,7.87) 6.24,7.87 6.49,7.62 USB1.A1 ; USB1.2 15.33,6.97 USB1.A12 ; C13.2 32.41,12.57 v1(28.43,12.57) C5.2
  vias: v1(0.66,11.3) v1(0.66,7.75) v1(0.78,4.83) v1(0.91,23.24) v1(2.69,12.83) v1(3.32,9.27) v1(3.45,11.94) v1(4.85,1.02) v1(5.1,27.18) v1(5.1,25.95) v1(5.48,5.71) v1(5.61,3.68) v1(8.73,0.76) v1(9.04,20.45) v1(9.7,27.18) v1(9.8,18.92) v1(10.69,27.18) v1(10.69,17.4) v1(10.69,16.26) v1(12.98,16.26) v1(13.48,4.06) v1(13.99,27.18) v1(14.37,0.76) v1(15.14,13.46) v1(15.3,11.92) v1(15.26,10.8) v1(15.9,21.21) v1(15.9,20.11) v1(16.61,16.13) v1(16.75,11.92) v1(17.03,21.21) v1(17.03,20.11) v1(18.22,27.18) v1(18.49,13.46) v1(19.2,16.13) v1(20.6,17.27) v1(21.36,21.34) v1(21.36,20) v1(21.76,13.93) v1(22.48,27.18) v1(22.48,25.57) v1(22.48,23.55) v1(23.77,13.59) v1(25.04,13.59) v1(25.04,12.45) v1(25.04,9.4) v1(25.8,18.03) v1(25.93,9.4) v1(26.06,4.32) v1(26.18,8.64) v1(26.31,0.76) v1(26.57,9.4) v1(26.78,24.38) v1(27.15,17.79) v1(27.33,9.4) v1(28.22,0.76) v1(28.47,22.48)
VBUS: length 27.4
  Top Layer w0.152: v1(18.54,6.35) 17.93,5.74 17.93,4.56 R12.1 ; 20,6.35 R17.1
  Top Layer w0.254: USB1.B9 9.08,6.82 10.56,5.33 13.1,5.33 v1(13.36,5.59) 13.36,6.47 13.88,6.99 USB1.A9
  Top Layer w0.508: 13.82,7.68 13.67,7.82 C4.2
  Top Layer w0.762: 25.1,7.99 24.67,7.99 24.4,7.71 24.4,6.72 24.03,6.35 v1(18.54,6.35)
  Bottom Layer w0.762: v1(18.54,6.35) 18.54,6.32 17.42,5.21 13.74,5.21 v1(13.36,5.59)
VCC_3V3: length 71.6
  Top Layer w0.152: R8.2 2.05,15.5 2.05,17.47 C7.2 ; 20.18,10.86 20.18,13.56 v1(20.22,13.59) ; 25.75,5.66 19.14,5.66 R9.1 ; 2.81,19.7 R2.2
  Top Layer w0.254: L1.2 10.68,13.32 11.63,14.27 19.53,14.27 v1(20.22,13.59) ; C6.2 20.85,10.86 19.51,10.86 R18.2
  Top Layer w0.762: 29.87,7.49 v1(29.87,5.71) ; 29.87,7.49 C13.1 ; 29.87,7.49 v1(29.87,11.56) ; C8.2 10.68,9.96 v1(10.68,10.62) L1.2
  Top Layer w1.016: 2.81,19.7 1.29,19.7 v1(1.29,19.05) C7.2
  Bottom Layer w0.152: v1(29.87,5.71) v1(25.68,5.71)
  Bottom Layer w0.762: v1(29.87,11.56) 22.25,11.56 v1(20.22,13.59)
  Bottom Layer w1.016: v1(10.68,10.62) 2.87,10.62 1.29,12.19 v1(1.29,19.05)
VCC_MCU: length 15.2
  Top Layer w1.016: v1(9.04,22.1) 9.04,26.11 8.32,26.83 U1.1 ; R3.1 v1(1.29,22.1)
  Bottom Layer w1.016: v1(1.29,22.1) 9.03,22.1 v1(9.04,22.1)
EN: length 19.7
  Top Layer w0.152: SW1.4 0.53,13.48 0.53,20.19 0.78,20.45 2.06,20.45 R2.1 4.27,19.75 4.34,19.75 5.1,20.51 5.1,23.28 5.48,23.66 5.48,24.64 6.17,25.33 U1.2
GPIO9: length 14.4
  Top Layer w0.152: SW2.4 1.6,8.95 3.98,11.33 3.98,12.85 4.72,13.59 6.62,13.59 v1(7.01,13.21) ; U1.8 7.08,16.64 v1(8.4,16.64)
  Bottom Layer w0.152: v1(7.01,13.21) 8.4,14.6 v1(8.4,16.64)
IO3: length 16.3
  Top Layer w0.152: v1(22.5,20.83) 22.5,21.21 23.62,22.33 U1.15 25.45,22.33 25.68,22.1 25.68,20.35 25.83,20.19 26.5,20.19 ; v1(22.5,18.41) 22.5,12.82 22.37,12.69
  Top Layer w0.762: R1.1 R5.2
  Bottom Layer w0.152: v1(22.5,20.83) v1(22.5,18.41)
IO4: length 8.2
  Top Layer w0.152: R10.1 2.82,18.29 3.58,19.05 4.87,19.05 5.27,19.46 5.27,20.31 5.48,20.52 5.48,23.05 6.27,23.83 U1.3
IO5: length 37.1
  Top Layer w0.152: v1(9.67,16.76) 9.67,17.64 8.14,19.18 8.14,21.73 7.54,22.33 U1.4 ; R14.1 17.29,6.73 15.16,4.6 5.33,4.6 4.21,5.71 4.21,10.54 4.85,11.18 4.85,11.69 5.09,11.94 6.08,11.94 6.36,12.22 8.05,12.22 v1(8.66,12.83)
  Bottom Layer w0.152: v1(8.66,12.83) 9.67,13.84 v1(9.67,16.76)
IO6: length 4
  Top Layer w0.152: U1.5 6.27,20.83 5.53,20.09 5.53,19.24 4.57,18.29 4.35,18.29 R20.2
IO7: length 34.9
  Top Layer w0.152: v1(9.04,15.49) 9.04,17.55 7.26,19.33 U1.6 ; 17.3,0.85 15.04,0.85 11.67,4.22 5.35,4.22 3.96,5.61 3.96,10.65 4.54,11.22 4.54,12.95 4.92,13.33 6.08,13.33 6.83,12.59 7.53,12.59 v1(7.9,12.95)
  Bottom Layer w0.152: v1(9.04,15.49) 9.04,14.1 v1(7.9,12.95)
USB_DN: length 30.2
  Top Layer w0.152: USB1.B7 10.58,6.06 10.84,5.79 11.34,5.79 11.58,6.03 USB1.A7 11.58,7.63 11.58,8.38 10.86,9.1 10,9.1 9.85,9.25 9.85,13.18 11.25,14.58 21.44,14.58 21.87,15.01 21.87,18.53 22.66,19.33 U1.13
USB_DP: length 31.4
  Top Layer w0.152: 11.14,14.83 9.6,13.29 9.6,8.91 9.75,8.75 10.57,8.75 11.08,8.25 USB1.A6 11.08,6.6 ; U1.14 23.53,20.83 21.61,18.91 21.61,15.11 21.33,14.83 11.14,14.83 ; v1(12.6,8.76) 12.47,8.76 12.08,8.37 USB1.B6 v2(12.08,6.48)
  Bottom Layer w0.152: v2(11.07,6.48) v2(12.08,6.48)
V_BAT: length 41.7
  Top Layer w0.254: R15.1 21.56,7.29 C11.2
  Top Layer w0.762: 22.34,9.78 22.29,9.74 17.46,9.74 16.56,10.64 16.56,10.73 U2.4 ; 22.34,9.78 22.94,9.78 ; 22.34,9.78 22.37,9.82 R1.2 ; 26,11.56 28.32,11.56 28.64,11.24 ; 26,11.56 25.74,11.56 25.23,11.05 ; 26,11.56 26.32,11.88 R11.1
  Top Layer w1.016: U4.1 25.82,2.17 28.64,4.99 28.64,11.24 ; v1(23.01,9.78) 23.01,9.71 23.01,9.71 C11.2
  Bottom Layer w1.27: U4.1 22.14,2.17 23.01,3.05 v1(23.01,9.78)
$1N674: length 1.5
  Top Layer w0.152: 27.13,7.05 R13.2
  Top Layer w0.762: 27.13,8.5 27.13,7.3
$1N676: length 18.7
  Top Layer w0.152: 27.13,10.8 27.45,10.8 27.95,10.3 27.95,5.96 27.15,5.16 19.61,5.16 19.45,5 19.45,1.61 18.69,0.85
$1N677: length 2.1
  Top Layer w0.152: 18.69,2.45 17.33,3.81 R12.2
$1N1245: length 2.4
  Top Layer w0.762: U2.3 13.1,10.86 12.48,11.48 L1.1
$1N1252: length 3
  Top Layer w0.254: U2.5 17.83,12.76 18.09,12.51 19.37,12.51 19.51,12.37
$1N1257: length 10.7
  Top Layer w0.152: U2.1 15.71,12.76 15.96,12.51 15.96,9.46 16.62,8.8 R14.2 R16.2
  Top Layer w0.254: R16.2 R17.2 R15.2
$1N2149: length 5.2
  Top Layer w0.152: U1.18 26.28,26.83 26.57,26.54 X1.2
  Top Layer w0.254: X1.2 27.59,25.63 R4.2
$1N2152: length 6.9
  Top Layer w0.152: 26.82,23.13 26.5,22.81 26.5,21.72 ; 26.82,23.13 X1.1 ; 26.82,23.13 26.82,23.26 24.75,25.33 U1.17
  Top Layer w0.254: R4.1 27.97,23.26 26.95,23.26 26.82,23.13
$1N2392: length 5.1
  Top Layer w0.152: R8.1 v1(4.59,15.37) ; v1(5.23,17.65) 6.59,17.65 U1.7
  Bottom Layer w0.152: v1(4.59,15.37) 4.72,15.49 4.85,15.49 5.23,15.88 v1(5.23,17.65)
$1N2588: length 3.3
  Top Layer w0.152: R9.2 16.54,4.58 16.54,3.2 17.29,2.45
$1N2840: length 34.1
  Top Layer w0.152: H1.1 31.52,17.65 29.23,15.37 28.22,15.37 27.33,16.26 v1(25.93,16.26) ; v1(21.07,15.49) 20.66,15.09 11.04,15.09 9.8,13.85 5.57,13.85 5.13,14.28 5.13,15.91 4.9,16.13 3.71,16.13 3.06,16.77 R10.2
  Bottom Layer w0.152: v1(21.07,15.49) 25.17,15.49 v1(25.93,16.26)
$1N2843: length 9.1
  Top Layer w1.27: H1.3 30.73,23.62 29.83,22.73 29.83,17.53 Q1.3
$1N2877: length 11.7
  Top Layer w1.27: R11.2 29.76,13.97 33.16,17.37 33.16,20.45 32.52,21.08 H1.2
$1N7161: length 30.3
  Top Layer w0.152: R20.1 4.98,16.77 5.41,16.34 5.41,14.36 5.67,14.1 9.69,14.1 10.96,15.37 19.83,15.37 v1(20.6,16.13)
  Top Layer w0.254: R21.2 27.96,18.66 27.96,17.53 v1(27.84,17.4) 27.64,17.21 26.09,17.21
  Bottom Layer w0.152: v1(20.6,16.13) 24.91,16.13 26.03,17.25 27.68,17.25 v1(27.84,17.4)
$1N33513: length 9
  Top Layer w0.152: R23.1 v1(8.53,9.14)
  Top Layer w0.254: USB1.B5 13.08,6.7 12.72,6.35 12.72,6.1 12.47,5.84
  Bottom Layer w0.152: v2(12.57,5.95) 12.47,5.84 10.82,5.84 10.18,6.48 10.18,7.49 v1(8.53,9.14)
$1N33602: length 5.2
  Top Layer w0.152: R24.2 7.04,8.77 7.31,8.5 9.91,8.5 10.08,8.33 USB1.A5

## Copper pours and planes (outline as drawn; the poured copper is in the pictures)
GND on Top Layer: -0.1,27.94 28.85,27.94 28.85,0 -0.1,0
GND on Bottom Layer: -0.1,27.97 28.85,27.97 28.85,0.03 -0.1,0.03

## Text on the board
Top Silkscreen Layer: RST | IO9 | - | + | GND | VCC | IO4 | ESP32-C3 / Smart Light / Controller
